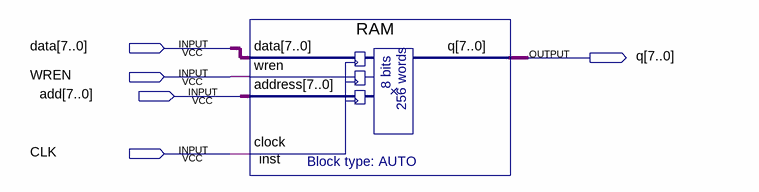
[diagram p0: schematic sheet]
// Quartus schematic exp8.bdf as structural Verilog: 1 symbols, 5 pins
module exp8 (
  input  [7:0] data,
  input  WREN,
  input  [7:0] add,
  input  CLK,
  output [7:0] q
);

  RAM inst (.data(data), .wren(WREN), .address(add), .clock(CLK), .q(q));
endmodule
